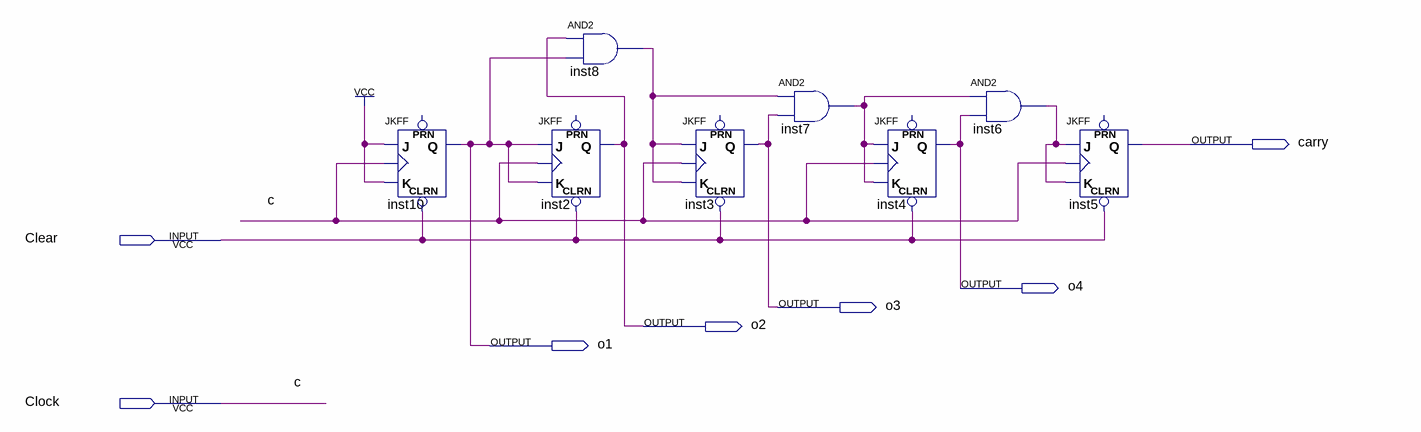
[diagram p0: schematic sheet]
// Quartus schematic Lab7A.bdf as structural Verilog: 8 symbols, 7 pins
module Lab7A (
  input  Clear,
  input  Clock,
  output carry,
  output o4,
  output o3,
  output o2,
  output o1
);

  wire inst6_out, inst7_out, inst8_out;

  JKFF inst10 (.CLRN(Clear), .K(1'b1), .J(1'b1), .CLK(Clock), .Q(o1));  // open: PRN
  and inst8 (inst8_out, o2, o1);
  JKFF inst2 (.CLRN(Clear), .K(o1), .J(o1), .CLK(Clock), .Q(o2));  // open: PRN
  JKFF inst3 (.CLRN(Clear), .K(inst8_out), .J(inst8_out), .CLK(Clock), .Q(o3));  // open: PRN
  and inst7 (inst7_out, inst8_out, o3);
  JKFF inst4 (.CLRN(Clear), .K(inst7_out), .J(inst7_out), .CLK(Clock), .Q(o4));  // open: PRN
  and inst6 (inst6_out, inst7_out, o4);
  JKFF inst5 (.CLRN(Clear), .K(inst6_out), .J(inst6_out), .CLK(Clock), .Q(carry));  // open: PRN

  // Other names for the same wires on the sheet: c = Clock
endmodule
